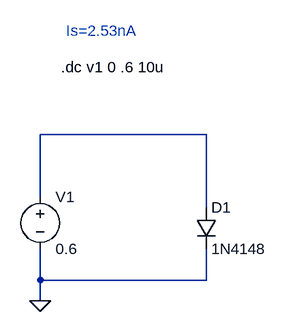
[diagram p0: schematic Multiplicadorx.asc]
Multiplicadorx.asc, the LTspice schematic file:
Version 4
SHEET 1 1492 680
WIRE -160 -720 -416 -720
WIRE -416 -624 -416 -720
WIRE -160 -608 -160 -720
WIRE -416 -496 -416 -544
WIRE -160 -496 -160 -544
WIRE -160 -496 -416 -496
WIRE -416 -464 -416 -496
FLAG -416 -464 0
SYMBOL diode -176 -608 R0
SYMATTR InstName D1
SYMATTR Value 1N4148
SYMBOL voltage -416 -640 R0
WINDOW 123 0 0 Left 0
WINDOW 39 0 0 Left 0
SYMATTR InstName V1
SYMATTR Value 0.6
TEXT -384 -824 Left 2 !.dc v1 0 .6 10u
TEXT -376 -880 Left 2 ;Is=2.53nA

The netlist it stands for:
* Multiplicadorx.asc
D1 N001 0 1N4148
V1 N001 0 0.6
.model D D
.lib standard.dio
.dc v1 0 .6 10u
* Is=2.53nA
.backanno
.end